# EasyEDA Pro project 完模驱动.eprj

# Schematic Schematic1
Board Name: Board1; Create Date: 2025-03-13; Page Name: P1; Project Name: 完模驱动; Schematic Name: Schematic1; Update Date: 2025-05-20; Company: 嘉立创EDA; Page Size: A4; Version: V1.0
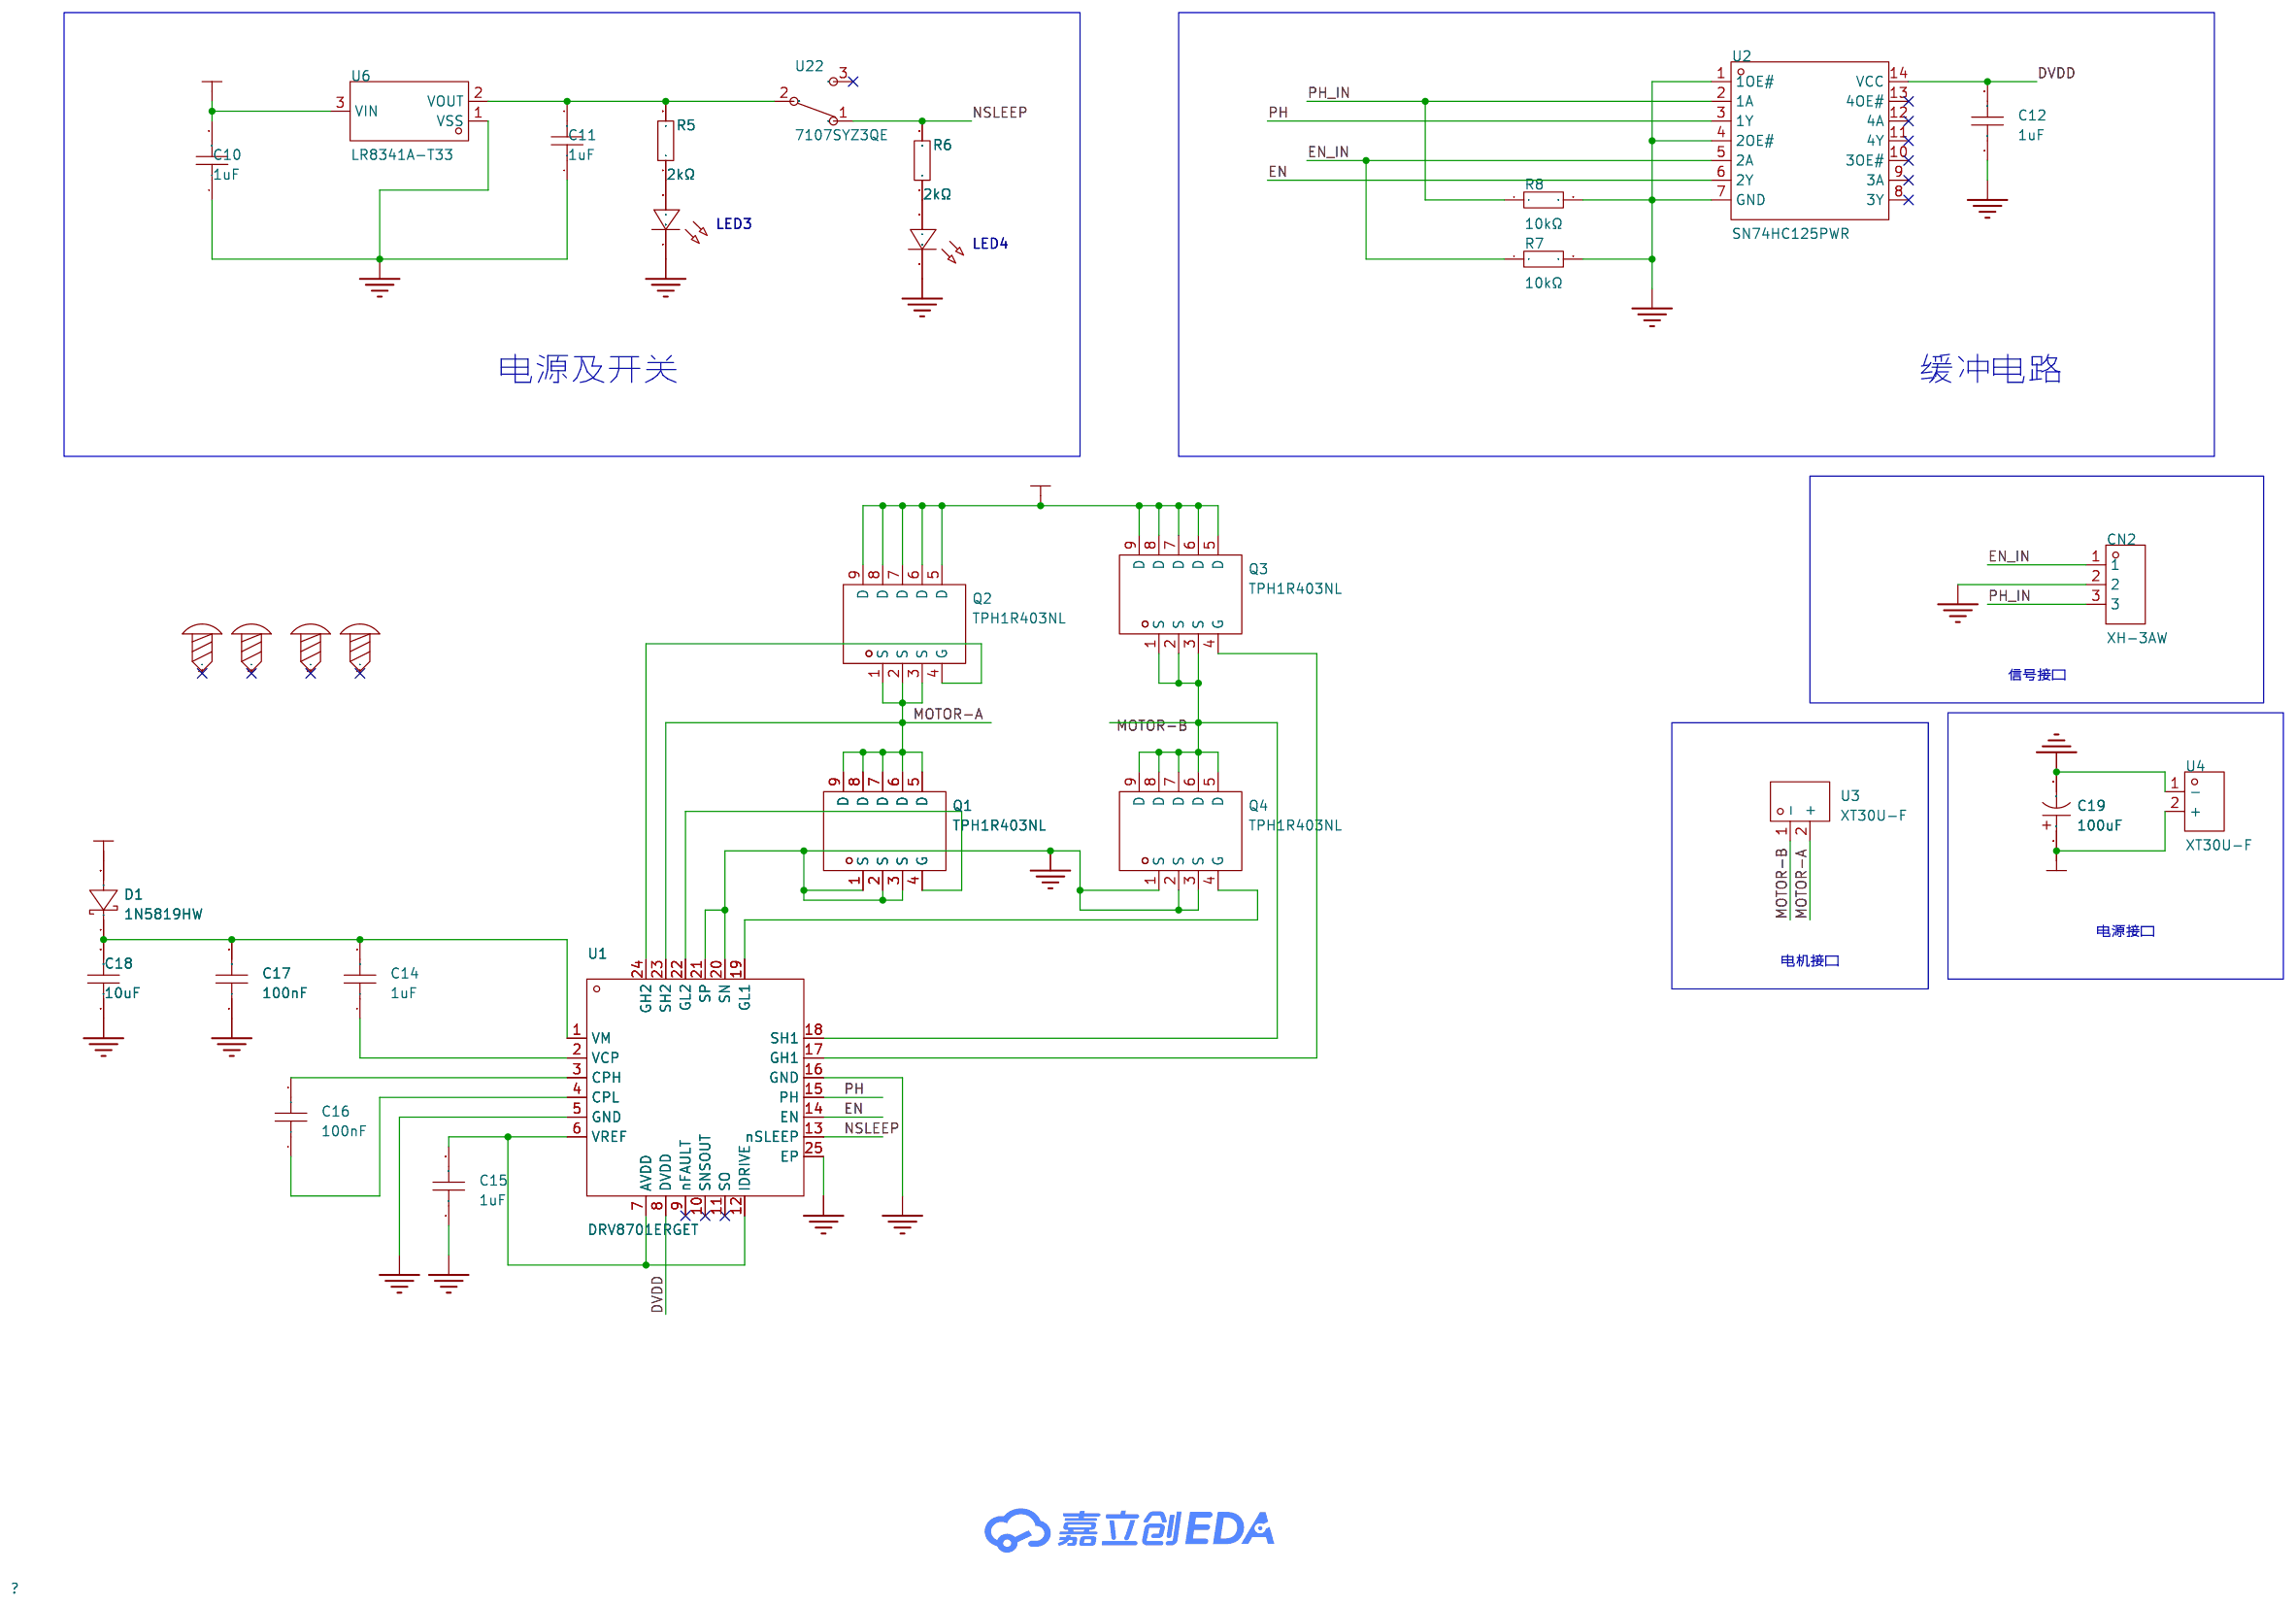
[diagram p0: schematic sheet]

## Parts
C10  1uF  [C0603]
C11  1uF  [C0603]
C12  1uF  [C0603]
C14  1uF  [C0603]
C15  1uF  [C0603]
C16  100nF  [C0603]
C17  100nF  [C0603]
C18  10uF  [C0603]
C19  100uF  [CAP-TH_BD6.3-P2.50-D0.6-FD-1]
CN2  XH-3AW  [CONN-TH_3P-P2.54_HCTL_XH-3AW]
D1  1N5819HW  [SOD-123_L2.7-W1.6-LS3.7-RD-1]
LED3  -  [LED_0805]
LED4  -  [LED_0805]
Q1  TPH1R403NL  [DSOP-8_L5.0-W5.0-P1.27-LS6.0-BL-EP]
Q2  TPH1R403NL  [DSOP-8_L5.0-W5.0-P1.27-LS6.0-BL-EP]
Q3  TPH1R403NL  [DSOP-8_L5.0-W5.0-P1.27-LS6.0-BL-EP]
Q4  TPH1R403NL  [DSOP-8_L5.0-W5.0-P1.27-LS6.0-BL-EP]
R5  2kΩ  [R0603]
R6  2kΩ  [R0603]
R7  10kΩ  [R0603]
R8  10kΩ  [R0603]
SCREW1  -  [M3螺丝]
SCREW2  -  [M3螺丝]
SCREW3  -  [M3螺丝]
SCREW4  -  [M3螺丝]
U1  DRV8701ERGET  [VQFN-24_L4.0-W4.0-P0.50-BL-EP2.5]
U2  SN74HC125PWR  [TSSOP-14_L5.0-W4.4-P0.65-LS6.5-BL]
U3  XT30U-F  [CONN-TH_XT30U-F]
U4  XT30U-F  [CONN-TH_XT30U-F]
U6  LR8341A-T33  [SOT-23-3L_L2.9-W1.6-P1.90-LS2.8-BL]
U22  7107SYZ3QE  [SW-TH_3P-L12.7-W6.8-P4.70]

## Library data of the parts
C10-C12 C14 C15 = CGA0603X5R105K500JT: LCSC Part Name: 1uF ±10% 50V; Supplier Part: C6119852; Manufacturer: HRE(芯声); Supplier Footprint: 0603; JLCPCB Part Class: 扩展库; Supplier: LCSC; Tolerance: ±10%; Voltage Rated: 50V; Temperature Coefficient: X5R
C16 C17 = CGA0603X7R104K500JT: LCSC Part Name: 100nF ±10% 50V; Supplier Part: C6119867; Manufacturer: HRE(芯声); Supplier Footprint: 0603; JLCPCB Part Class: 扩展库; Supplier: LCSC; Tolerance: ±10%; Voltage Rated: 50V; Temperature Coefficient: X7R
C18 = HGC0603R5106M160NTHJ: LCSC Part Name: 10uF ±20% 16V; Supplier Part: C7472959; Manufacturer: Chinocera(华瓷); Supplier Footprint: 0603; JLCPCB Part Class: 扩展库; Datasheet: https://atta.szlcsc.com/upload/public/pdf/source/20240320/FAC3FEC40A78BC5CCCE96C232A94D860.pdf; Supplier: LCSC; Tolerance: ±20%; Voltage Rated: 16V; Temperature Coefficient: X5R
C19 = PA50V100M6x12: LCSC Part Name: 100uF ±20% 50V; Supplier Part: C46550456; Manufacturer: 捷而瑞; Supplier Footprint: 插件,D6.3xL12mm; JLCPCB Part Class: 扩展库; Datasheet: https://atta.szlcsc.com/upload/public/pdf/source/20250307/831193F737CAF6D75AC25F14E955F0EC.pdf; Supplier: LCSC; Tolerance: ±20%; Voltage Rating: 50V; Ripple Current: 2.98A@100Hz; Equivalent Series Resistance(ESR): 25mΩ@100kHz; Diameter: 6.3mm; Height - Seated (Max): 12mm; Lifetime: 2000hrs@105℃; Operating Temperature: -55℃~+105℃
CN2 = XH-3AW_C2908612: LCSC Part Name: 1x3P 间距:2.54mm 弯插 系列:XH; Supplier Part: C2908612; Manufacturer: HCTL(华灿天禄); Supplier Footprint: 弯插,P=2.5mm; JLCPCB Part Class: 扩展库; Datasheet: https://atta.szlcsc.com/upload/public/pdf/source/20230711/B565BAF3B11666EF6B81B3605408F2BD.pdf; Supplier: LCSC; Pins Structure: 1x3P; Pitch: 2.54mm; Mounting Style: 弯插; Reference Series: XH; Number of Pins: 3P; Number of Rows: 1; Number of PINs Per Row: 3; Current Rating (Max): 3A; Contact Material: 黄铜; Contact Plating: 锡; Operating Temperature Range: -25℃~+85℃
D1 = 1N5819HW: 二极管配置:-;正向压降(Vf):900mV@3A;直流反向耐压(Vr):40V;平均整流电流(Io):1A;; LCSC Part Name: 电压:40V 电流:1A; Supplier Part: C2905649; Manufacturer: TECH PUBLIC(台舟); Supplier Footprint: SOD-123; JLCPCB Part Class: 扩展库; Datasheet: https://atta.szlcsc.com/upload/public/pdf/source/20211020/8C6B6169F42B21129AF0D528B0E96B00.pdf; Supplier: LCSC; Forward Voltage (Vf@If): 900mV@3A; Reverse Voltage (Vr): 40V; Average Rectified Current (Io): 1A; Reverse Leakage Current (Ir): 1mA@40V
LED3 LED4 = LED_0805-G: Supplier Footprint: 0805
Q1-Q4 = TPH1R403NL_C83440: 类型:N沟道;漏源电压(Vdss):30V;连续漏极电流(Id):150A;功率(Pd):64W;导通电阻(RDS(on)@Vgs,Id):1.4mΩ@10V,30A;阈值电压(Vgs(th)@Id):2.3V@500uA;; LCSC Part Name: N沟道 耐压:30V 电流:150A; Supplier Part: C83440; Manufacturer: TOSHIBA(东芝); Supplier Footprint: DFN-8(5x6); JLCPCB Part Class: 扩展库; Datasheet: https://atta.szlcsc.com/upload/public/pdf/source/20170908/C83440_1504870121708958077.pdf; Supplier: LCSC; Type: N沟道; Drain Source Voltage (Vdss): 30V; Continuous Drain Current (Id): 150A; Power Dissipation (Pd): 64W; Drain Source On Resistance (RDS(on)@Vgs,Id): 1.4mΩ@10V,30A; Gate Threshold Voltage (Vgs(th)@Id): 2.3V@500uA
R5 R6 = 0603WAF2001T5E: LCSC Part Name: 2kΩ ±1% 100mW 厚膜电阻; Supplier Part: C22975; Manufacturer: UNI-ROYAL(厚声); Supplier Footprint: 0603; JLCPCB Part Class: 基础库; Datasheet: https://atta.szlcsc.com/upload/public/pdf/source/20200306/C422600_1E6D84923E4A46A82E41ADD87F860B5C.pdf; Supplier: LCSC; Type: 厚膜电阻; Tolerance: ±1%; Power(Watts): 100mW; Overload Voltage (Max): 75V; Temperature Coefficient: ±100ppm/℃; Operating Temperature Range: -55℃~+155℃
R7 R8 = 0603WAF1002T5E: LCSC Part Name: 厚膜电阻 10kΩ ±1% 100mW; Supplier Part: C25804; Manufacturer: UNI-ROYAL(厚声); Supplier Footprint: 0603; JLCPCB Part Class: 基础库; Datasheet: https://atta.szlcsc.com/upload/public/pdf/source/20200306/C422600_1E6D84923E4A46A82E41ADD87F860B5C.pdf; Supplier: LCSC; Type: 厚膜电阻; Tolerance: ±1%; Power(Watts): 100mW; Overload Voltage (Max): 75V; Temperature Coefficient: ±100ppm/℃; Operating Temperature Range: -55℃~+155℃
SCREW1-SCREW4 = M3螺丝: Supplier Footprint: 插件
U1 = DRV8701ERGET: 驱动电机类型:有刷直流电机;电源电压:0V~5.5V;输出电流:-;接口:并行;; LCSC Part Name: 有刷直流电机驱动芯片 5.5V; Supplier Part: C132049; Manufacturer: TI(德州仪器); Supplier Footprint: VQFN-24(4x4); JLCPCB Part Class: 扩展库; Datasheet: https://www.ti.com/cn/lit/gpn/drv8701; Supplier: LCSC; Drive motor type: 有刷直流电机; Supply Voltage: 0V~5.5V; Interface: 并行; Operating Temperature: -40℃~+125℃@(Ta)
U2 = SN74HC125PWR: 输入类型:-;电源电压:2V~6V;元件数:4;每个元件位数:1;灌电流(IOL):7.8mA;拉电流(IOH):7.8mA;; Supplier Part: C132994; Manufacturer: TI(德州仪器); Supplier Footprint: TSSOP-14; JLCPCB Part Class: 扩展库; Datasheet: https://www.ti.com/cn/lit/gpn/sn74hc125; Supplier: LCSC; output type: 三态; Supply Voltage: 2V~6V; Number of Elements: 4; Number of Bits per Element: 1; Sink Current: 7.8mA; Source Current: 7.8mA; Logic Family: 74HC; Operating Temperature: -40℃~+85℃
U3 U4 = XT30U-F: 类别:-;类型1:-;; LCSC Part Name: AMASS(艾迈斯)轻量版锂电池插头母头 XT30U-F; Supplier Part: C99102; Manufacturer: AMASS(艾迈斯); JLCPCB Part Class: 扩展库; Datasheet: https://atta.szlcsc.com/upload/public/pdf/source/20190916/C428721_B0ECB8C5937139CEFE8736D2D3175B0E.pdf; Supplier: LCSC; Brand: 艾迈斯; Type: 插头; Colour: 黄色; InterfaceType: 母头
U6 = LR8341A-T33: 输出类型:固定;最大输入电压:40V;输出电压:3.3V;最大输出电流:100mA;电源纹波抑制比(PSRR):55dB@(1kHz);输出极性:正极;; LCSC Part Name: 输入40V 输出3.3V 100mA; Supplier Part: C2829465; Manufacturer: LR(朗瑞); Supplier Footprint: SOT-23-3L; JLCPCB Part Class: 扩展库; Datasheet: https://atta.szlcsc.com/upload/public/pdf/source/20210426/C2829465_61F15D7ACE9671B48D4F69A8092B0D8F.pdf; Supplier: LCSC; Output Type: 固定; Maximum Input Voltage: 40V; Output Voltage: 3.3V; MAX Output Current: 100mA; Power Supply Rejection Ratio (PSRR): 55dB@(1kHz); standby current: 2uA; Operating Temperature: -40℃~+85℃; Output Polarity: 正极; Number of Outputs: 1
U22 = 7107SYZ3QE: 电路结构:单刀双掷;额定电压(AC):120V;额定电压(DC):28V;安装方式:直插;; LCSC Part Name: 7107SYZ3QE 五件套; Supplier Part: C2807218; Manufacturer: CK; Supplier Footprint: 插件; JLCPCB Part Class: Extended Part; Datasheet: https://atta.szlcsc.com/upload/public/pdf/source/20211115/F8CC6A82C29CD42100901D8BBE4E1986.pdf; Supplier: LCSC; Circuit: 单刀双掷; Voltage Rating (AC): 120V; Voltage Rating (DC): 28V; Actuator Type: 圆柱钮柄; Mounting Style: 直插; Operating Temperature: -30℃~+85℃

## Nets
DVDD: C12.2 U1.8(DVDD) U2.14(VCC)
GND: C10.1 C11.1 C12.1 C15.1 C17.1 C18.1 C19.2 CN2.2 LED3.1(C) LED4.1(C) Q1.1(S) Q1.2(S) Q1.3(S) Q4.1(S) Q4.2(S) Q4.3(S) R7.2 R8.2 U1.5(GND) U1.16(GND) U1.20(SN) U1.21(SP) U1.25(EP) U2.1(1OE#) U2.4(2OE#) U2.7(GND) U4.1(-) U6.1(VSS)
VIN: C10.2 C19.1 D1.2(A) Q2.5(D) Q2.6(D) Q2.7(D) Q2.8(D) Q2.9(D) Q3.5(D) Q3.6(D) Q3.7(D) Q3.8(D) Q3.9(D) U4.2(+) U6.3(VIN)
EN: U1.14(EN) U2.6(2Y)
EN_IN: CN2.1 R7.1 U2.5(2A)
MOTOR-A: Q1.5(D) Q1.6(D) Q1.7(D) Q1.8(D) Q1.9(D) Q2.1(S) Q2.2(S) Q2.3(S) U1.23(SH2) U3.2(+)
MOTOR-B: Q3.1(S) Q3.2(S) Q3.3(S) Q4.5(D) Q4.6(D) Q4.7(D) Q4.8(D) Q4.9(D) U1.18(SH1) U3.1(-)
NSLEEP: R6.2 U1.13(nSLEEP) U22.1(ON)
PH: U1.15(PH) U2.3(1Y)
PH_IN: CN2.3 R8.1 U2.2(1A)
$1N386: C11.2 R5.2 U6.2(VOUT) U22.2(COMM)
$1N602: LED3.2(A) R5.1
$1N693: LED4.2(A) R6.1
$1N2406: C15.2 U1.6(VREF) U1.7(AVDD) U1.12(IDRIVE)
$1N2414: C16.2 U1.3(CPH)
$1N2415: C16.1 U1.4(CPL)
$1N2420: C14.1 U1.2(VCP)
$1N2421: C14.2 C17.2 C18.2 D1.1(K) U1.1(VM)
$1N2428: Q2.4(G) U1.24(GH2)
$1N2429: Q3.4(G) U1.17(GH1)
$1N2431: Q1.4(G) U1.22(GL2)
$1N2432: Q4.4(G) U1.19(GL1)

Not connected (* = marked no-connect by the designer): SCREW1 1*; SCREW2 1*; SCREW3 1*; SCREW4 1*; U1 9(nFAULT)* 10(SNSOUT)* 11(SO)*; U2 8(3Y)* 9(3A)* 10(3OE#)* 11(4Y)* 12(4A)* 13(4OE#)*; U22 3(NC)*

## Notes on the sheet
- 电源及开关
- 缓冲电路
- 信号接口
- 电源接口
- 电机接口

# Board PCB1
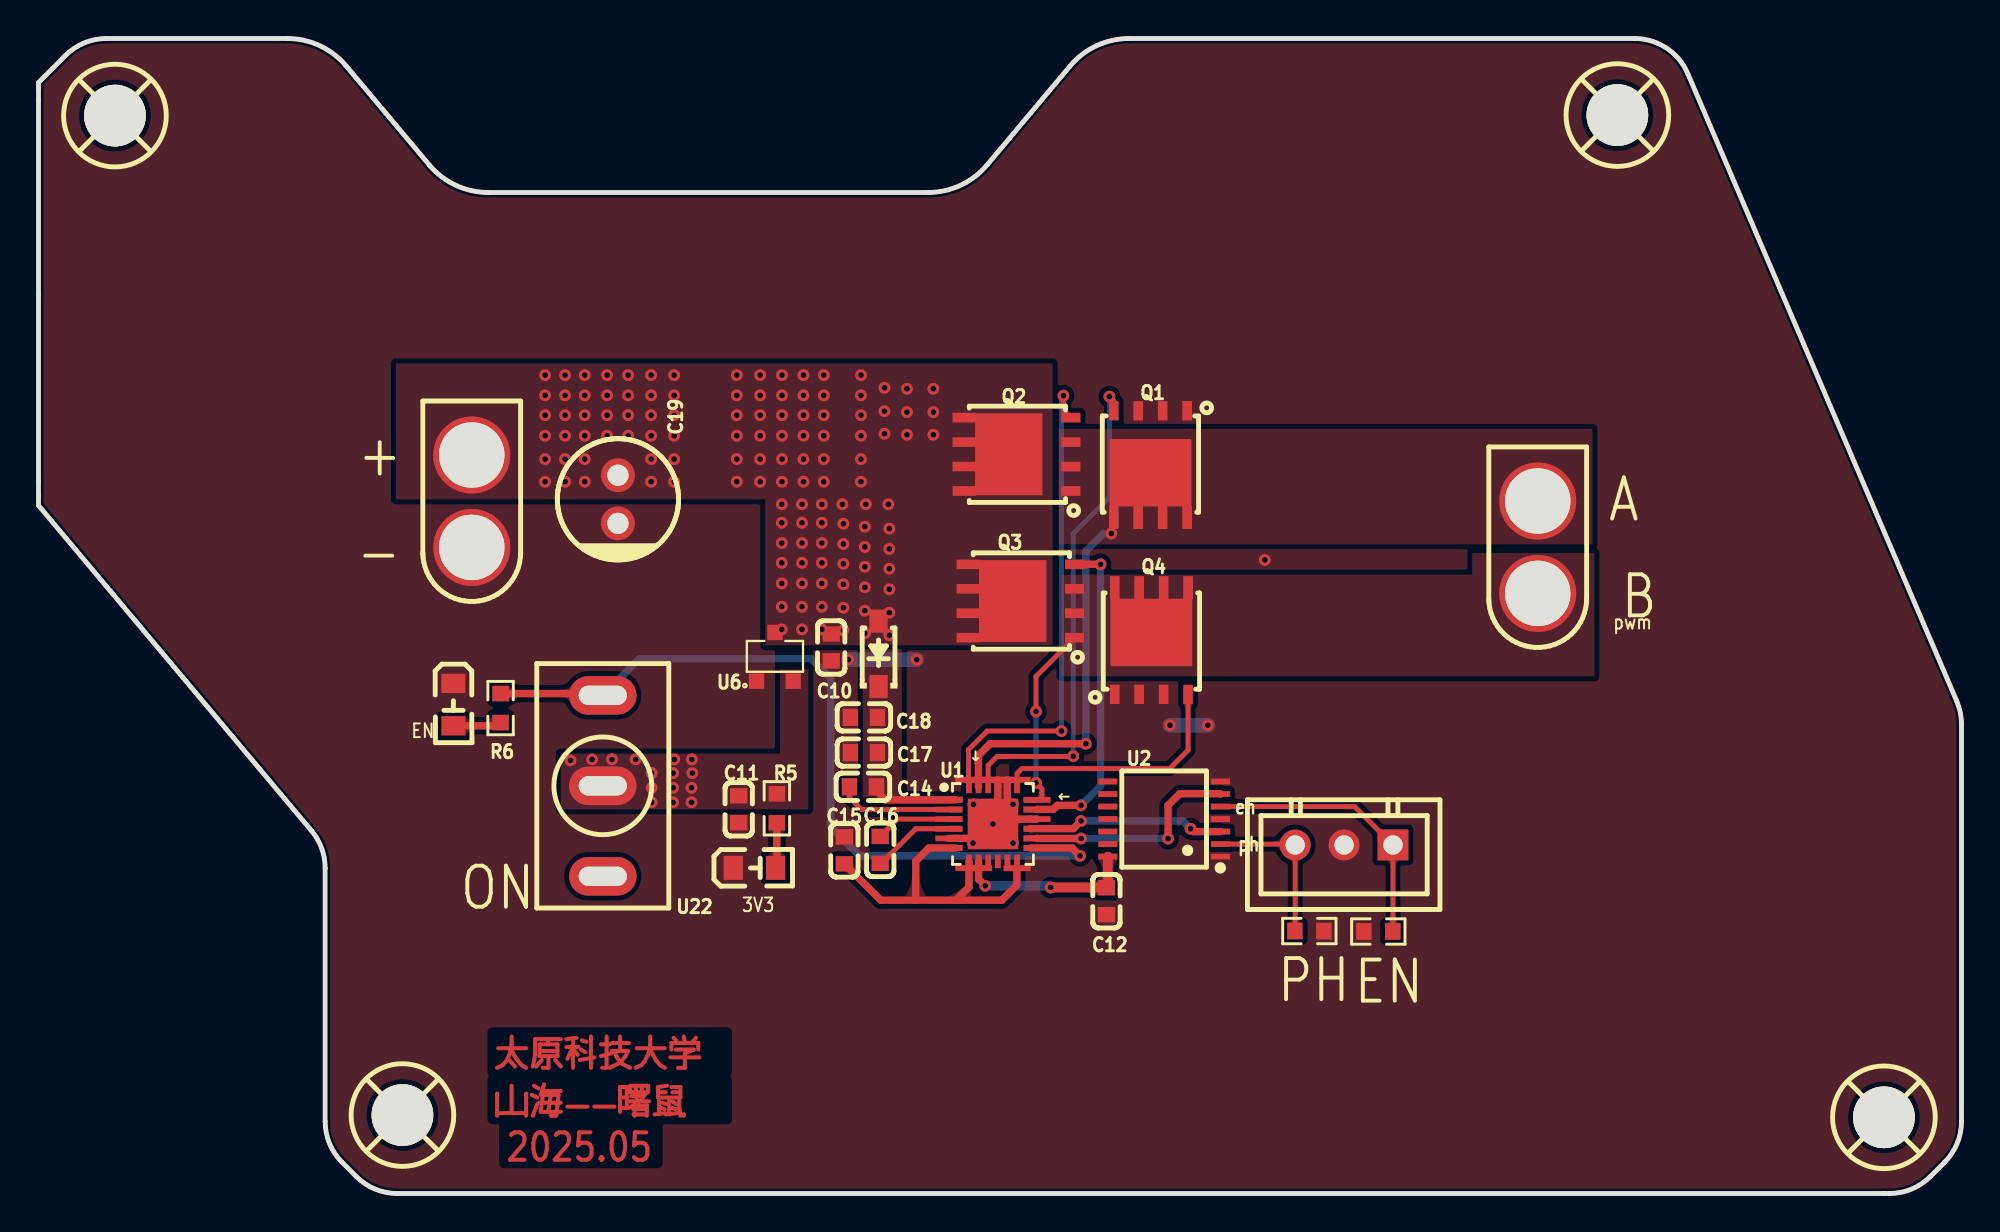
[diagram p1: board, top side]
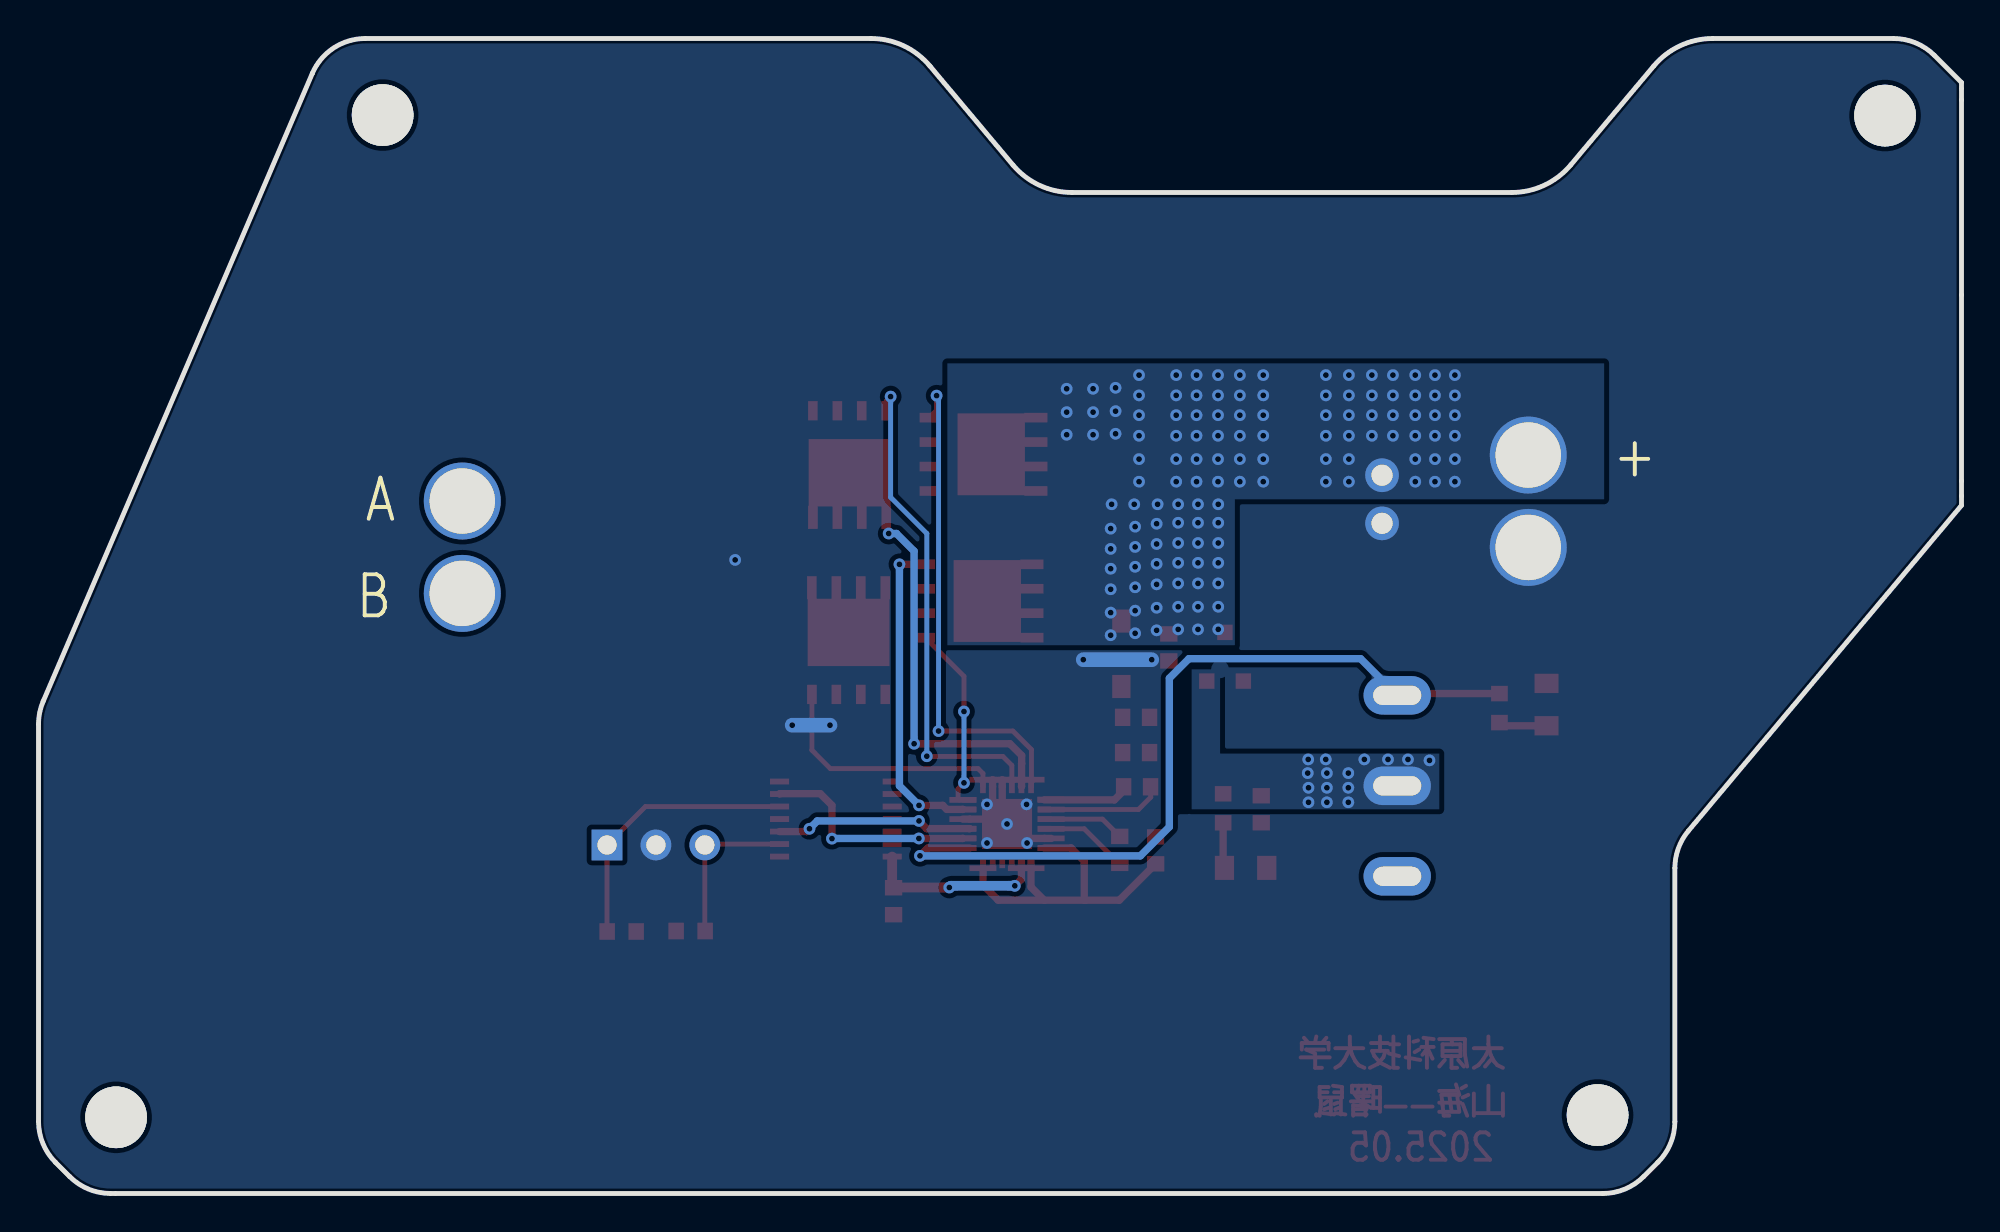
[diagram p2: board, bottom side, seen from below]

Outline 99.89 x 60 mm; copper layers: Top Layer, Bottom Layer. Coordinates in mm from the lower left corner of the outline.
Outline path: 0,57.71 1.41,59.12 arc(2.38,59.77) 3.53,60 12.92,60 arc(14.61,59.63) 15.98,58.57 20.3,53.43 arc(21.67,52.37) 23.36,52 46.21,52 arc(47.9,52.37) 49.27,53.43 53.59,58.57 arc(54.96,59.63) 56.65,60 82.91,60 arc(84.56,59.5) 85.67,58.18 99.65,25.57 arc(99.83,24.99) 99.89,24.38 99.89,3.74 arc(99.66,2.59) 99.01,1.62 98.27,0.88 arc(97.29,0.23) 96.15,0 18.63,0 arc(17.48,0.23) 16.51,0.88 15.77,1.62 arc(15.12,2.59) 14.89,3.74 14.89,16.91 arc(14.71,17.93) 14.19,18.84 0,35.74 0,57.71
Stack: Top Layer 0.035mm / Dielectric1 1.51mm FR4 er 4.5 / Bottom Layer 0.035mm

## Design rules (mm)
template: 自定义配置
spacing copperThickness1oz (default): track to track 0.102, other pairs 0.152 to 0.3
spacing copperThickness2oz: track to track 0.203, other pairs 0.152 to 0.3
track width copperThickness1oz (default): min 0.127, default 0.254, max 2.54
track width copperThickness2oz: min 0.203, default 0.254, max 2.54
differential pair differentialPair (default): width min 0.127, default 0.254, max 2.54; gap min 0.152, default 0.152
via viaSize (default): diameter min 0.5, default 0.61, max 10; hole min 0.3, default 0.305, max 6.3

## Placement (name value [footprint] x y rotation side)
C10  1uF  [C0603]  41.18 28.37 90 top
C11  1uF  [C0603]  36.37 19.96 90 top
C12  1uF  [C0603]  55.47 15.18 90 top
C14  1uF  [C0603]  42.83 21.13 0 top
C15  1uF  [C0603]  41.86 17.83 270 top
C16  100nF  [C0603]  43.73 17.85 90 top
C17  100nF  [C0603]  42.88 22.91 0 top
C18  10uF  [C0603]  42.88 24.73 0 top
C19  100uF  [CAP-TH_BD6.3-P2.50-D0.6-FD-1]  30.1 36.06 270 top
CN1  ZX-XH2.54-3PZZ  [CONN-TH_3P-P2.54_2501S-3P]  67.82 18.11 180 top
D1  1N5819HW  [SOD-123_L2.7-W1.6-LS3.7-RD-1]  43.64 28.04 90 top
LED3  -  [LED_0805]  37.24 16.91 0 top
LED4  -  [LED_0805]  21.55 25.35 270 top
NOREF  -  [Pad_e37]  48.33 16.9 90 top
NOREF#2  -  [Pad_e50]  48.33 21.5 270 top
NOREF#3  -  [Pad_e61]  51.87 18.95 180 top
NOREF#4  -  [Pad_e43]  50.83 16.9 90 top
NOREF#5  -  [Pad_e44]  47.29 17.95 0 top
NOREF#6  -  [Pad_e53]  49.33 21.5 270 top
NOREF#7  -  [Pad_e57]  51.87 20.45 180 top
NOREF#8  -  [Pad_e47]  47.29 19.45 0 top
NOREF#9  -  [Pad_e48]  47.29 19.95 0 top
NOREF#10  -  [Pad_e49]  47.31 20.47 0 top
NOREF#11  -  [Pad_e63]  51.87 17.95 180 top
NOREF#12  -  [Pad_e45]  47.29 18.45 0 top
NOREF#13  -  [Pad_e60]  51.87 19.45 180 top
NOREF#14  -  [Pad_e55]  50.33 21.5 270 top
NOREF#15  -  [Pad_e46]  47.29 18.95 0 top
NOREF#16  -  [Pad_e59]  51.87 19.95 180 top
NOREF#17  -  [Pad_e56]  50.83 21.5 270 top
NOREF#18  -  [Pad_e38]  48.83 16.9 90 top
NOREF#19  -  [Pad_e54]  49.83 21.5 270 top
NOREF#20  -  [Pad_e52]  48.83 21.5 270 top
NOREF#21  -  [Pad_e62]  51.87 18.45 180 top
Q1  TPH1R403NL  [DSOP-8_L5.0-W5.0-P1.27-LS6.0-BL-EP]  57.76 37.89 180 top
Q2  TPH1R403NL  [DSOP-8_L5.0-W5.0-P1.27-LS6.0-BL-EP]  50.85 38.4 90 top
Q3  TPH1R403NL  [DSOP-8_L5.0-W5.0-P1.27-LS6.0-BL-EP]  51.05 30.78 90 top
Q4  TPH1R403NL  [DSOP-8_L5.0-W5.0-P1.27-LS6.0-BL-EP]  57.81 28.7 0 top
R5  2kΩ  [R0603]  38.35 20.01 90 top
R6  2kΩ  [R0603]  24 25.22 90 top
R7  10kΩ  [R0603]  69.6 13.61 180 top
R8  10kΩ  [R0603]  66.02 13.63 0 top
SCREW1  -  [M3螺丝]  3.97 56 0 top
SCREW2  -  [M3螺丝]  82.01 56.02 0 top
SCREW3  -  [M3螺丝]  18.9 4.08 0 top
SCREW4  -  [M3螺丝]  95.86 3.96 0 top
U1  DRV8701ERGET  [VQFN-24_L4.0-W4.0-P0.50-BL-EP2.5]  49.58 19.2 270 top
U2  SN74HC125PWR  [TSSOP-14_L5.0-W4.4-P0.65-LS6.5-BL]  58.47 19.45 90 top
U3  XT30U-F  [CONN-TH_XT30U-F]  77.88 33.57 270 top
U4  XT30U-F  [CONN-TH_XT30U-F]  22.5 35.96 270 top
U6  LR8341A-T33  [SOT-23-3L_L2.9-W1.6-P1.90-LS2.8-BL]  38.25 27.88 0 top
U22  7107SYZ3QE  [SW-TH_3P-L12.7-W6.8-P4.70]  29.31 21.18 270 top

## Footprints (pads in the part's own frame, mm; a bottom-side part is the same pattern mirrored in y, then rotated)
C0603
  rect 0.8x0.9 smd: 1(-0.7,0) 2(0.7,0)
CAP-TH_BD6.3-P2.50-D0.6-FD-1
  round 1.75 hole 1.1: 1(-1.25,0) 2(1.25,0)
CONN-TH_3P-P2.54_2501S-3P
  rect 1.6x1.6 hole 1: 1(-2.54,0)
  round 1.6 hole 1: 2(0,0) 3(2.54,0)
CONN-TH_XT30U-F
  round 4 hole 3.4: 1(2.4,0) 2(-2.4,0)
DSOP-8_L5.0-W5.0-P1.27-LS6.0-BL-EP
  rect 0.5x1 smd: 1(-1.905,-2.77) 2(-0.635,-2.77) 3(0.634,-2.77) 4(1.905,-2.77)
  rect 0.5x1.2 smd: 5(1.905,2.77) 6(0.635,2.77) 7(-0.634,2.77) 8(-1.905,2.77)
  custom 4.25x3.5 smd: 9(0,0.45)
LED_0805
  rect 1x1.25 smd: 1(-1.15,0.005) 2(1.05,0.005)
M3螺丝
  round 3.2 hole 3.2: 1(0,0)
Pad_e37
  custom 0.3x1.401 smd: 1(0,0)
Pad_e38
  custom 0.3x1.401 smd: 1(0,0)
Pad_e43
  custom 0.3x1.401 smd: 1(0,0)
Pad_e44
  custom 1.401x0.3 smd: 1(0,0)
Pad_e45
  custom 1.401x0.3 smd: 1(0,0)
Pad_e46
  custom 1.401x0.3 smd: 1(0,0)
Pad_e47
  custom 1.401x0.3 smd: 1(0,0)
Pad_e48
  custom 1.401x0.3 smd: 1(0,0)
Pad_e49
  custom 1.401x0.3 smd: 1(0,0)
Pad_e50
  custom 0.3x1.401 smd: 1(0,0)
Pad_e52
  custom 0.3x1.401 smd: 1(0,0)
Pad_e53
  custom 0.3x1.401 smd: 1(0,0)
Pad_e54
  custom 0.299x1.401 smd: 1(0,0)
Pad_e55
  custom 0.3x1.401 smd: 1(0,0)
Pad_e56
  custom 0.3x1.401 smd: 1(0,0)
Pad_e57
  custom 1.401x0.3 smd: 1(0,0)
Pad_e59
  custom 1.401x0.3 smd: 1(0,0)
Pad_e60
  custom 1.401x0.3 smd: 1(0,0)
Pad_e61
  custom 1.401x0.3 smd: 1(0,0)
Pad_e62
  custom 1.401x0.3 smd: 1(0,0)
Pad_e63
  custom 1.401x0.3 smd: 1(0,0)
R0603
  rect 0.806x0.864 smd: 1(-0.753,0) 2(0.753,0)
SOD-123_L2.7-W1.6-LS3.7-RD-1
  rect 1.2x0.95 smd: 1(-1.7,0) 2(1.7,0)
SOT-23-3L_L2.9-W1.6-P1.90-LS2.8-BL
  rect 0.8x0.8 smd: 1(-0.95,-1.265) 2(0.95,-1.265) 3(0.005,1.265)
SW-TH_3P-L12.7-W6.8-P4.70
  oval 2x3.5 hole 1x2.5: 1(-4.7,0) 2(0,0) 3(4.7,0)
TSSOP-14_L5.0-W4.4-P0.65-LS6.5-BL
  rect 0.305x0.991 smd: 1(-1.95,-2.925) 2(-1.3,-2.925) 3(-0.65,-2.925) 4(0,-2.925) 5(0.65,-2.925) 6(1.3,-2.925) 7(1.95,-2.925) 8(1.95,2.925) 9(1.3,2.925) 10(0.65,2.925) 11(0,2.925) 12(-0.65,2.925) 13(-1.3,2.925) 14(-1.95,2.925)
VQFN-24_L4.0-W4.0-P0.50-BL-EP2.5
  rect 0.3x0.7 smd: 1(-1.25,-1.942) 2(-0.75,-1.942) 3(-0.25,-1.942) 4(0.25,-1.942) 5(0.75,-1.942) 6(1.25,-1.942) 13(1.25,1.942) 14(0.75,1.942) 15(0.25,1.942) 16(-0.25,1.942) 17(-0.75,1.942) 18(-1.25,1.942)
  rect 0.7x0.3 smd: 7(1.948,-1.25) 8(1.948,-0.75) 9(1.948,-0.25) 10(1.948,0.25) 11(1.948,0.75) 12(1.948,1.25) 19(-1.948,1.25) 20(-1.948,0.75) 21(-1.948,0.25) 22(-1.948,-0.25) 23(-1.948,-0.75) 24(-1.948,-1.25)
  rect 2.6x2.6 smd: 25(0.001,-0.001)

## Nets
DVDD: C12.2 NOREF#18.1 U1.8 U2.14
GND: C10.1 C11.1 C12.1 C15.1 C17.1 C18.1 C19.2 CN1.2 LED3.1 LED4.1 NOREF#12.1 NOREF#13.1 NOREF#14.1 NOREF#19.1 Q1.1 Q1.2 Q1.3 Q4.1 Q4.2 Q4.3 R7.2 R8.2 U1.5 U1.16 U1.20 U1.21 U1.25 U2.1 U2.4 U2.7 U4.1 U6.1
VIN: C10.2 C19.1 D1.2 Q2.5 Q2.6 Q2.7 Q2.8 Q2.9 Q3.5 Q3.6 Q3.7 Q3.8 Q3.9 U4.2 U6.3
EN: NOREF#21.1 U1.14 U2.6
EN_IN: CN1.1 R7.1 U2.5
MOTOR-A: NOREF#20.1 Q1.5 Q1.6 Q1.7 Q1.8 Q1.9 Q2.1 Q2.2 Q2.3 U1.23 U3.2
MOTOR-B: NOREF#7.1 Q3.1 Q3.2 Q3.3 Q4.5 Q4.6 Q4.7 Q4.8 Q4.9 U1.18 U3.1
NSLEEP: NOREF#11.1 R6.2 U1.13 U22.1
PH: NOREF#3.1 U1.15 U2.3
PH_IN: CN1.3 R8.1 U2.2
$1N386: C11.2 R5.2 U6.2 U22.2
$1N602: LED3.2 R5.1
$1N693: LED4.2 R6.1
$1N2406: C15.2 NOREF.1 NOREF#4.1 NOREF#5.1 U1.6 U1.7 U1.12
$1N2414: C16.2 NOREF#8.1 U1.3
$1N2415: C16.1 NOREF#15.1 U1.4
$1N2420: C14.1 NOREF#9.1 U1.2
$1N2421: C14.2 C17.2 C18.2 D1.1 NOREF#10.1 U1.1
$1N2428: NOREF#2.1 Q2.4 U1.24
$1N2429: NOREF#16.1 Q3.4 U1.17
$1N2431: NOREF#6.1 Q1.4 U1.22
$1N2432: NOREF#17.1 Q4.4 U1.19

Pads without a net: SCREW1 1; SCREW2 1; SCREW3 1; SCREW4 1; U1 9 10 11; U2 8 9 10 11 12 13; U22 3

## Via types
v1: diameter 0.61, hole 0.305, Top Layer to Bottom Layer, 167 vias

## Routing (per net, layer and track width the routed paths; a pad name or vN(x,y) marks a point on that pad's centre or on a via; arc(x,y) is an arc through that point)
DVDD: length 9.4
  Top Layer w0.381: v1(49.17,15.98) 48.83,16.33 48.83,17.25
  Top Layer w0.508: v1(52.58,15.9) 55.46,15.9 C12.2 55.55,15.96 55.55,17.5
  Bottom Layer w0.508: v1(52.58,15.9) 52.49,15.98 v1(49.17,15.98)
GND: length 14.8
  Top Layer w0.381: NOREF#14.1 50.33,19.95 49.83,19.45 ; 49.83,19.45 NOREF#19.1 ; 49.83,19.45 49.83,19.45 ; 49.83,19.45 v1(49.58,19.2) 48.83,18.45 U1.5 NOREF#12.1 ; 49.83,19.45 NOREF#13.1
  Bottom Layer w0.762: v1(58.78,24.33) v1(60.74,24.33) ; v1(42.06,27.73) v1(45.62,27.73)
  vias: v1(48.57,20.21) v1(48.54,18.21) v1(50.62,20.21) v1(50.62,18.21) v1(63.7,32.91)
VIN:
  vias: v1(26.31,42.51) v1(26.31,41.46) v1(26.31,40.43) v1(26.31,39.36) v1(26.31,38.15) v1(26.31,36.98) v1(27.35,42.51) v1(27.35,41.46) v1(27.35,40.43) v1(27.35,39.36) v1(27.35,38.15) v1(27.35,36.98) v1(28.37,42.51) v1(28.37,41.46) v1(28.37,40.43) v1(28.37,39.36) v1(28.37,38.15) v1(28.37,36.98) v1(29.53,42.51) v1(29.53,41.46) v1(29.53,40.43) v1(29.53,39.36) v1(30.63,42.51) v1(30.63,41.46) v1(30.63,40.43) v1(30.63,39.36) v1(31.82,42.51) v1(31.82,41.46) v1(31.82,40.43) v1(31.82,39.36) v1(31.82,38.15) v1(31.82,36.98) v1(33.02,42.51) v1(33.02,41.46) v1(33.02,40.43) v1(33.02,39.36) v1(33.02,38.15) v1(33.02,36.98) v1(36.27,42.51) v1(36.27,41.46) v1(36.27,40.43) v1(36.27,39.36) v1(36.27,38.15) v1(36.27,36.98) v1(37.49,42.51) v1(37.49,41.46) v1(37.49,40.43) v1(37.49,39.36) v1(37.49,38.15) v1(37.49,36.98) v1(38.62,42.51) v1(38.62,41.46) v1(38.62,40.43) v1(38.62,39.36) v1(38.62,38.15) v1(38.62,36.98) v1(38.61,35.8) v1(38.61,34.84) v1(38.61,33.79) v1(38.61,32.76) v1(38.61,31.69) v1(38.61,30.48) v1(38.61,29.31) v1(39.66,35.8) v1(39.66,34.84) v1(39.66,33.79) v1(39.66,32.76) v1(39.66,31.69) v1(39.66,30.48) v1(39.66,29.31) v1(39.74,42.51) v1(39.74,41.46) v1(39.74,40.43) v1(39.74,39.36) v1(39.74,38.15) v1(39.74,36.98) v1(40.69,35.8) v1(40.69,34.84) v1(40.69,33.79) v1(40.69,32.76) v1(40.69,31.69) v1(40.69,30.48) v1(40.69,29.31) v1(40.79,42.51) v1(40.79,41.46) v1(40.79,40.43) v1(40.79,39.36) v1(40.79,38.15) v1(40.79,36.98) v1(41.76,35.8) v1(41.81,34.79) v1(41.81,33.74) v1(41.81,32.71) v1(41.81,31.64) v1(41.81,30.43) v1(41.81,29.26) v1(42.72,42.51) v1(42.72,41.46) v1(42.72,40.43) v1(42.72,39.36) v1(42.72,38.15) v1(42.72,36.98) v1(42.93,34.64) v1(42.93,33.59) v1(42.93,32.56) v1(42.93,31.49) v1(42.93,30.28) v1(42.93,29.1) v1(42.97,35.8) v1(43.94,41.85) v1(43.94,40.64) v1(43.94,39.47) v1(44.15,35.8) v1(44.2,34.54) v1(44.2,33.49) v1(44.2,32.46) v1(44.2,31.39) v1(44.2,30.18) v1(44.2,29) v1(45.11,41.8) v1(45.11,40.59) v1(45.11,39.42) v1(46.48,41.8) v1(46.48,40.59) v1(46.48,39.42)
EN: length 11.5
  Top Layer w0.381: v1(54.16,18.44) 51.88,18.44 NOREF#21.1 ; v1(58.67,18.44) 58.67,20.16 59.28,20.77 61.38,20.77 U2.6
  Bottom Layer w0.381: v1(58.67,18.44) 58.67,18.44 v1(54.16,18.44)
EN_IN: length 14.3
  Top Layer w0.254: R7.1 70.36,13.62 CN1.1 68.36,20.1 U2.5
MOTOR-A: length 19.2
  Top Layer w0.381: U1.23 48.82,21.15 48.82,22.33 48.82,22.34 48.82,22.75 49.43,23.36 v1(54.41,23.36)
  Bottom Layer w0.381: v1(55.73,34.28) 55.32,34.28 54.41,33.37 v1(54.41,23.36)
MOTOR-B: length 9.6
  Top Layer w0.254: v1(51.82,25.04) 51.82,26.87 Q3.1 ; v1(51.82,21.33) 52.12,21.03 52.12,20.47 52.1,20.45 NOREF#7.1
  Bottom Layer w0.254: v1(51.82,25.04) v1(51.82,21.33)
NSLEEP: length 42.4
  Top Layer w0.381: R6.2 29.22,25.97 U22.1 ; v1(54.1,17.54) 53.7,17.95 U1.13
  Bottom Layer w0.381: U22.1 31.22,27.78 40.13,27.78 41.15,26.77 41.15,19.05 42.65,17.54 v1(54.1,17.54)
PH: length 10.3
  Top Layer w0.381: 61.4,18.8 59.99,18.8 v1(59.84,18.95) ; v1(54.15,19.35) 53.75,18.95 51.53,18.95 U1.15
  Bottom Layer w0.381: v1(59.84,18.95) 59.44,19.35 v1(54.15,19.35)
PH_IN: length 8.4
  Top Layer w0.254: U2.2 65.23,18.15 CN1.3 65.28,13.65 R8.1
$1N386:
  vias: v1(27.64,22.5) v1(28.75,22.55) v1(29.79,22.55) v1(31.02,22.55) v1(31.85,21.84) v1(31.85,21.08) v1(31.85,20.32) v1(32.96,21.84) v1(32.96,21.08) v1(32.96,20.32) v1(33.02,22.55) v1(33.94,22.55) v1(33.96,21.84) v1(33.92,21.08) v1(33.92,20.32)
$1N602: length 2.4
  Top Layer w0.381: R5.1 38.35,16.98 LED3.2
$1N693: length 2.5
  Top Layer w0.381: R6.1 23.84,24.3 LED4.2
$1N2406: length 17.7
  Top Layer w0.381: 45.53,15.23 47.65,15.23 ; 45.53,15.23 45.57,15.27 45.57,17.27 46.25,17.95 U1.6 ; 45.53,15.23 43.75,15.23 C15.2 ; 47.65,15.23 50.04,15.23 50.82,16.02 50.82,16.89 NOREF#4.1 ; 47.65,15.23 48.33,15.92 NOREF.1 48.33,17.25
$1N2414: length 4.3
  Top Layer w0.254: C16.2 44.62,19.45 NOREF#8.1 U1.3
$1N2415: length 4.3
  Top Layer w0.254: C16.1 43.78,17.15 45.57,18.95 NOREF#15.1
$1N2420: length 6.3
  Top Layer w0.254: C14.1 42.11,21.12 42.11,20.59 42.75,19.95 NOREF#9.1 U1.2
$1N2421: length 4.3
  Top Layer w0.381: U1.1 44,20.45 43.52,20.92
$1N2428: length 25.9
  Top Layer w0.254: 53.62,40.3 53.24,40.69 v1(53.24,41.45) ; U1.24 48.31,21.17 48.31,23.06 49.28,24.02 v1(53.14,24.02)
  Bottom Layer w0.254: v1(53.24,41.45) 53.14,41.35 v1(53.14,24.02)
$1N2429: length 16.7
  Top Layer w0.381: v1(54.15,20.16) 52.92,20.16 52.71,19.95 51.88,19.95 NOREF#16.1 ; Q3.4 v1(55.17,32.68)
  Bottom Layer w0.381: v1(54.15,20.16) 55.17,21.18 v1(55.17,32.68)
$1N2431: length 25.6
  Top Layer w0.254: NOREF#6.1 49.33,22.24 49.79,22.7 53.73,22.7 v1(53.75,22.72) ; v1(55.63,41.4) 55.86,41.17 Q1.4
  Bottom Layer w0.254: v1(55.63,41.4) 55.63,36.16 53.75,34.28 v1(53.75,22.72)
$1N2432: length 13
  Top Layer w0.254: Q4.4 59.71,23.03 58.76,22.07 51.08,22.07 50.83,21.82 U1.19

## Copper pours and planes (outline as drawn; the poured copper is in the pictures)
GND on Top Layer: -1.98,68.42 105.72,68.42 105.72,-9.45 -1.98,-9.45
GND on Bottom Layer: -3.7,64.15 112.68,64.15 112.68,-3.46 -3.7,-3.46
VIN on Top Layer: 18.56,43.12 52.68,43.12 52.68,28.48 18.56,28.48
VIN on Bottom Layer: 18.56,43.12 52.68,43.12 52.68,28.48 18.56,28.48
MOTOR-A on Top Layer: 52.98,39.72 80.72,39.72 80.72,33.73 52.98,33.73
MOTOR-B on Top Layer: 53.14,33.27 80.82,33.27 80.82,26.87 53.14,26.87
$1N386 on Top Layer: 27.13,27.23 39.99,27.23 39.99,19.96 27.13,19.96
$1N386 on Bottom Layer: 27.13,27.23 39.99,27.23 39.99,19.96 27.13,19.96
$1N2421 on Top Layer: 42.82,28.28 44.85,28.28 44.85,20.58 42.82,20.58

Small or netless copper shapes (teardrops, artwork), in the pictures only: 42 on Top Layer, 17 on Bottom Layer

## Text on the board
Bottom Silkscreen Layer: + | A | B
Top Layer: 2025.05 | 太原科技大学 | 山海——曙鼠
Top Solder Mask Layer: 2025.05 | 太原科技大学 | 山海——曙鼠
Top Silkscreen Layer: EN | 3V3 | pwm | en | ph | - | + | ON | PH | A | B | →
